# EAGLE design regboard (EAGLE 5.12)
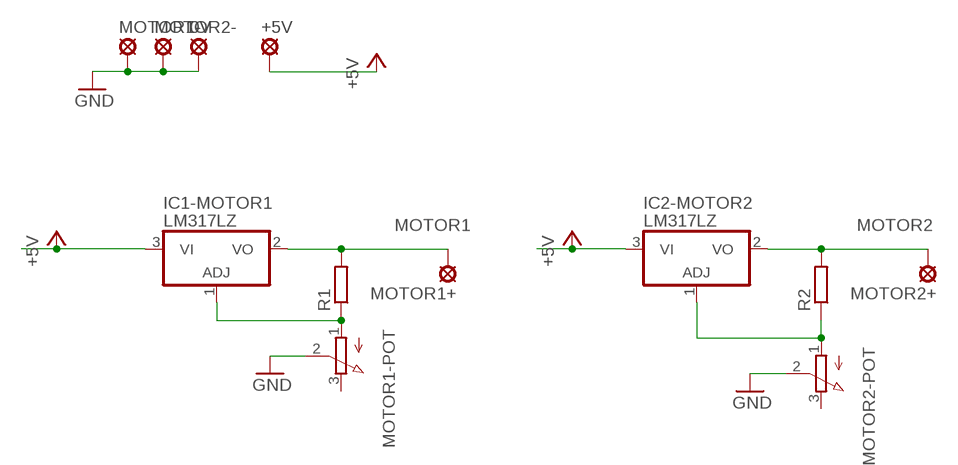
[diagram p0: schematic, sheet 1]

## Parts
0V  SE11  [SE11]
+5V  SE11  [SE11]
IC1-MOTOR1  LM317LZ  [TO92]
IC2-MOTOR2  LM317LZ  [TO92]
MOTOR1+  SE11  [SE11]
MOTOR1-  SE11  [SE11]
MOTOR1-POT  3RP/1610N  [3RP/1610N]
MOTOR2+  SE11  [SE11]
MOTOR2-  SE11  [SE11]
MOTOR2-POT  3RP/1610N  [3RP/1610N]
R1  R-EU_0207/12  [0207/12]
R2  R-EU_0207/12  [0207/12]

## Nets
+5V: +5V.MP IC1-MOTOR1.3(VI) IC2-MOTOR2.3(VI)
GND: 0V.MP MOTOR1-.MP MOTOR1-POT.2(S) MOTOR2-.MP MOTOR2-POT.2(S)
MOTOR1: IC1-MOTOR1.2(VO) MOTOR1+.MP R1.2
MOTOR2: IC2-MOTOR2.2(VO) MOTOR2+.MP R2.2
N$7: IC1-MOTOR1.1(ADJ) MOTOR1-POT.1(A) R1.1
N$8: IC2-MOTOR2.1(ADJ) MOTOR2-POT.1(A) R2.1
Unconnected: MOTOR1-POT.3(E) MOTOR2-POT.3(E)

## Library data of the parts
0V +5V MOTOR1+ MOTOR1- MOTOR2+ MOTOR2- = solpad:SE11: SOLDER PAD RTM, drill 1,1mm, distributor Buerklin, 07F810
IC1-MOTOR1 IC2-MOTOR2 = matt:*317: Positive VOLTAGE REGULATOR
MOTOR1-POT MOTOR2-POT = pot:3RP/1610N: 16mm Potentiometer one level Source: http://www.alphapotentiometers.net/html/16mm_pot_2.html
R1 R2 = matt rcl:R-EU_: RESISTOR, European symbol

## Net classes
0 default: width 0.381 mm

## Board
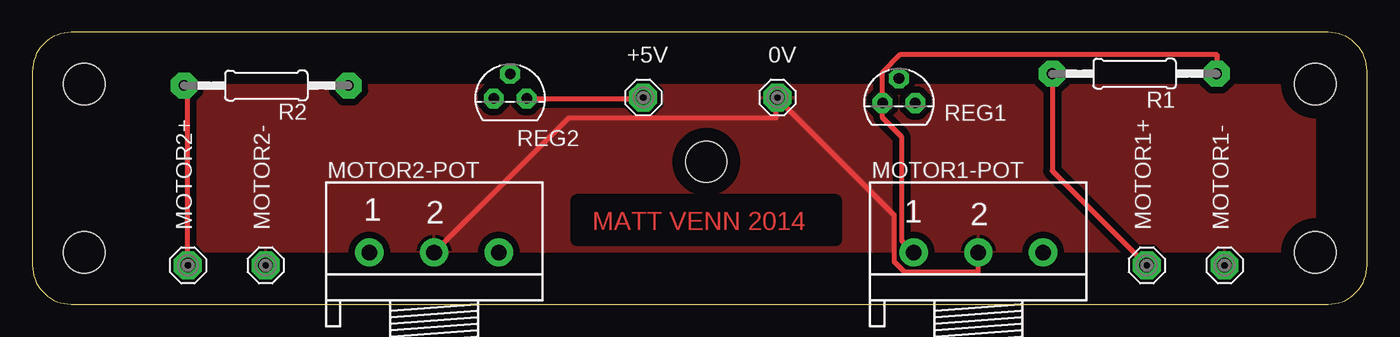
[diagram p1: board, top side]
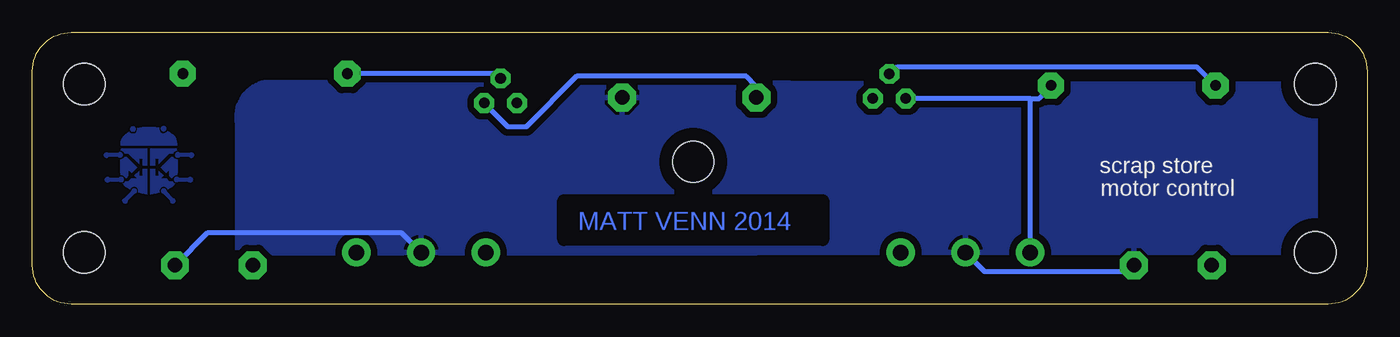
[diagram p2: board, bottom side, seen from below]

Size 103 x 21 mm. Coordinates in mm from the lower left corner, seen from the top.
Outline: 3,21 arc90 0,18 0,3 arc90 3,0 100,0 arc90 103,3 103,18 arc90 100,21 3,21
Copper layers (1*16): Top 0.035mm / dielectric 1.5mm / Bottom 0.035mm
Design rules "default": minimum track width 10mil, minimum drill 24mil, track to track 8mil, track to pad 8mil, pad to pad 8mil, via to via 8mil, smd to smd 8mil, copper to edge 40mil, drill to drill 8mil, minimum pad ring 10mil, minimum via ring 8mil, stop-mask expansion 4mil, vias tented up to drill 0mil, thermal gap 10mil
Holes 3.2 mm at 52,11 4,4 4,17 99,17 99,4
tRestrict: area 42,5 to 62,8
bRestrict: area 42,5 to 62,8

### Footprints (pad centres in the part's own frame; a part is rotated, then mirrored left to right if it is on the bottom)
SE11 = drill 1.118 pad 2.159 octagon: MP 0,0
TO92 = drill 0.813 pad 1.524 octagon: 1 -1.27,0; 2 0,1.905; 3 1.27,0
3RP/1610N = drill 1.2 pad 2.184 round: 1 -5,0; 2 0,0; 3 5,0
0207/12 = drill 0.813 pad 2.032 octagon: 1 -6.35,0; 2 6.35,0

### Placement (x,y rotation side)
0V  57.49,15.97 0 top
+5V  47.14,15.97 0 top
IC1-MOTOR1  66.87,15.54 0 top
IC2-MOTOR2  36.87,15.89 0 top
MOTOR1+  86,3 0 top
MOTOR1-  92,3 0 top
MOTOR1-POT  73,4 0 top
MOTOR2+  12,3 0 top
MOTOR2-  18,3 0 top
MOTOR2-POT  31,4 0 top
R1  85.05,17.81 180 top
R2  18.05,16.89 180 top

### Tracks (layer width: path | path; a pad name or v marks a point on that pad's centre or on a via)
+5V
  Top 0.381: IC2-MOTOR2.3 38.2,15.9 47.1,15.9 +5V.MP
  Bottom 0.381: IC1-MOTOR1.3 66.3,13.7 64.9,13.7 61,17.6 47.9,17.6 47.2,16.9 47.2,16 +5V.MP
GND
  Top 0.381: MOTOR1-POT.2 73,2.5 67.3,2.5 66.5,3.3 66.5,6.9 57.5,15.9 0V.MP 57.4,15.8 57.4,14.4 41.4,14.4 MOTOR2-POT.2
  Bottom 0.381: MOTOR2-.MP 18.5,2.5 29.5,2.5 MOTOR2-POT.2 | MOTOR1-.MP 89.5,5.5 74.5,5.5 MOTOR1-POT.2
  pour Bottom (isolate 0.5): 4,17 85.01,17.14 arc-90 87.17,13.93 87.17,3.93 7,4 arc-90 4,7
  pour Top (isolate 0.5): 4,17 96,17 arc-90 99,14 99,4 7,4 arc-90 4,7
MOTOR1
  Top 0.381: MOTOR1+.MP 78.7,10.3 R1.2
  Bottom 0.381: IC1-MOTOR1.2 66.9,17.5 67.2,17.8 R1.2
MOTOR2
  Top 0.381: MOTOR2+.MP 12,16.5 11.7,16.8 R2.2
  Bottom 0.381: 36.6,18 36.8,17.8 IC2-MOTOR2.2 36.5,18.1 36.3,18.3 13.1,18.3 R2.2
N$1
  pour Bottom: 93.5,13.67 93.2,13.64 93.22,13.53 93.2,13.4 93.12,13.29 93.01,13.22 92.88,13.19 92.78,13.21 92.7,13.25 92.63,13.31 92.58,13.39 92.42,13.28 92.27,13.19 92.15,13.09 92.04,12.99 91.95,12.88 91.89,12.74 91.85,12.58 91.84,12.38 91.84,12.3 91.84,12.26 96.18,12.26 96.19,12.3 96.19,12.38 96.17,12.57 96.14,12.72 96.08,12.84 96.01,12.94 95.91,13.04 95.8,13.13 95.68,13.22 95.53,13.32 95.48,13.26 95.41,13.21 95.33,13.18 95.25,13.16 95.11,13.19 95.01,13.26 94.93,13.37 94.91,13.5 94.93,13.62 94.73,13.65 94.52,13.67
N$2
  pour Bottom: 93.09,13.56 93.08,13.52 93.07,13.48 93.05,13.44 93.03,13.41 92.99,13.38 92.96,13.36 92.92,13.35 92.88,13.35 92.83,13.35 92.79,13.36 92.76,13.38 92.73,13.41 92.7,13.44 92.68,13.48 92.67,13.52 92.66,13.56 92.67,13.6 92.68,13.64 92.7,13.68 92.73,13.71 92.76,13.73 92.79,13.75 92.83,13.77 92.88,13.77 92.92,13.77 92.96,13.75 92.99,13.73 93.03,13.71 93.05,13.68 93.07,13.64 93.08,13.6
N$3
  pour Bottom: 95.45,13.53 95.45,13.49 95.43,13.45 95.42,13.41 95.39,13.38 95.36,13.36 95.32,13.34 95.28,13.32 95.24,13.32 95.2,13.32 95.16,13.34 95.12,13.36 95.09,13.38 95.06,13.41 95.04,13.45 95.03,13.49 95.03,13.53 95.03,13.57 95.04,13.61 95.06,13.65 95.09,13.68 95.12,13.71 95.16,13.73 95.2,13.74 95.24,13.74 95.28,13.74 95.32,13.73 95.36,13.71 95.39,13.68 95.42,13.65 95.43,13.61 95.45,13.57
N$4
  pour Bottom: 91.78,11.74 91.73,11.74 91.68,11.72 91.64,11.69 91.61,11.66 90.89,11.66 90.82,11.71 90.74,11.72 90.7,11.72 90.66,11.71 90.62,11.69 90.59,11.66 90.57,11.63 90.55,11.59 90.53,11.55 90.53,11.51 90.53,11.47 90.55,11.43 90.57,11.39 90.59,11.36 90.62,11.34 90.66,11.32 90.7,11.3 90.74,11.3 90.79,11.31 90.84,11.32 90.88,11.35 90.92,11.39 91.62,11.39 91.65,11.36 91.69,11.34 91.73,11.32 91.78,11.32 91.82,11.32 91.86,11.33 91.9,11.35 91.93,11.38 91.95,11.41 91.97,11.45 91.98,11.49 91.99,11.53 91.98,11.57 91.97,11.61 91.95,11.65 91.93,11.68 91.9,11.71 91.86,11.72 91.82,11.74
N$5
  pour Bottom: 91.86,12.02 91.86,12.01 91.85,11.98 91.85,11.93 91.84,11.86 91.93,11.84 92.02,11.8 92.08,11.74 92.13,11.66 92.43,11.66 93.24,10.84 93.24,11.25 93.51,11.25 93.51,10.71 93.89,10.71 93.89,12.02
N$6
  pour Bottom: 92.13,11.39 92.08,11.3 92.01,11.24 91.92,11.2 91.82,11.18 91.8,11.18 91.79,10.88 91.79,10.57 91.8,10.26 91.82,9.97 91.88,9.97 91.98,9.96 92.08,9.91 92.15,9.84 92.2,9.76 92.29,9.76 92.43,9.89 92.43,10.38 92.67,10.14 93.11,10.57 92.29,11.39
N$7
  Top 0.381: R1.1 91.4,19.3 67,19.3 65.6,17.9 IC1-MOTOR1.1 65.6,14.4 67.1,12.9 67.1,4.9 MOTOR1-POT.1
N$8
  Bottom 0.381: 26,15.9 IC2-MOTOR2.1 | 26,15.9 25.3,15.9 24.4,16.8 R2.1 | MOTOR2-POT.1 26,15.9
N$9
  pour Bottom: 93.51,10.44 93.51,9.89 93.24,9.89 93.24,10.3 92.88,9.93 93.11,9.7 92.64,9.7 92.43,9.48 92.19,9.48 92.15,9.43 92.11,9.38 92.05,9.34 91.99,9.31 91.99,9.31 92.09,9.18 92.22,9.06 92.37,8.96 92.55,8.87 92.6,8.95 92.67,9.02 92.76,9.06 92.86,9.07 92.99,9.05 93.1,8.98 93.17,8.87 93.2,8.73 93.19,8.64 93.33,8.6 93.46,8.57 93.58,8.55 93.68,8.53 93.77,8.51 93.84,8.5 93.88,8.49 93.89,8.49 93.89,10.44
N$10
  pour Bottom: 91.86,9.85 91.81,9.84 91.77,9.82 91.73,9.8 91.69,9.77 90.97,9.77 90.9,9.81 90.82,9.83 90.78,9.82 90.74,9.81 90.7,9.79 90.67,9.77 90.65,9.73 90.63,9.7 90.61,9.66 90.61,9.62 90.61,9.57 90.63,9.53 90.65,9.5 90.67,9.47 90.7,9.44 90.74,9.42 90.78,9.41 90.82,9.4 90.87,9.41 90.92,9.43 90.96,9.46 91,9.49 91.7,9.49 91.73,9.47 91.77,9.44 91.81,9.43 91.86,9.42 91.9,9.43 91.94,9.44 91.98,9.46 92.01,9.49 92.03,9.52 92.05,9.55 92.07,9.59 92.07,9.64 92.07,9.68 92.05,9.72 92.03,9.75 92.01,9.78 91.98,9.81 91.94,9.83 91.9,9.84
N$11
  pour Bottom: 92.86,8.96 92.78,8.94 92.71,8.89 92.66,8.81 92.65,8.71 92.15,8.19 92.08,8.18 92.01,8.13 91.96,8.06 91.95,7.98 91.97,7.9 92.02,7.83 92.09,7.78 92.17,7.77 92.25,7.79 92.31,7.84 92.35,7.88 92.37,7.92 92.37,7.97 92.37,8.02 92.86,8.53 92.94,8.55 93.02,8.6 93.06,8.67 93.08,8.75 93.06,8.83 93.01,8.9 92.94,8.94
N$12
  pour Bottom: 96.24,11.74 96.2,11.74 96.16,11.72 96.12,11.71 96.09,11.68 96.06,11.65 96.04,11.61 96.03,11.57 96.03,11.53 96.03,11.49 96.04,11.45 96.06,11.41 96.09,11.38 96.12,11.35 96.16,11.33 96.2,11.32 96.24,11.32 96.33,11.34 96.4,11.39 97.1,11.39 97.14,11.35 97.18,11.32 97.22,11.31 97.28,11.3 97.32,11.3 97.36,11.32 97.39,11.34 97.42,11.36 97.45,11.39 97.47,11.43 97.48,11.47 97.49,11.51 97.48,11.55 97.47,11.59 97.45,11.63 97.42,11.66 97.39,11.69 97.36,11.71 97.32,11.72 97.28,11.72 97.19,11.71 97.13,11.66 96.4,11.66 96.37,11.69 96.33,11.72 96.29,11.74
N$13
  pour Bottom: 96.16,12.02 96.16,12.01 96.16,11.98 96.17,11.93 96.18,11.86 96.08,11.84 96,11.8 95.94,11.74 95.89,11.66 95.59,11.66 94.77,10.84 94.77,11.25 94.5,11.25 94.5,10.71 94.12,10.71 94.12,12.02
N$14
  pour Bottom: 95.89,11.39 95.94,11.3 96.01,11.24 96.1,11.2 96.2,11.18 96.22,11.18 96.23,10.88 96.23,10.57 96.22,10.26 96.2,9.97 96.14,9.97 96.03,9.96 95.94,9.91 95.87,9.84 95.82,9.76 95.73,9.76 95.59,9.89 95.59,10.38 95.35,10.14 94.91,10.57 95.73,11.39
N$15
  pour Bottom: 94.5,10.44 94.5,9.89 94.77,9.89 94.77,10.3 95.14,9.93 94.91,9.7 95.37,9.7 95.59,9.48 95.83,9.48 95.86,9.43 95.91,9.38 95.96,9.34 96.03,9.31 96.02,9.31 95.93,9.18 95.8,9.06 95.64,8.96 95.47,8.87 95.42,8.95 95.35,9.02 95.26,9.06 95.16,9.07 95.02,9.05 94.92,8.98 94.84,8.87 94.82,8.73 94.83,8.64 94.69,8.6 94.56,8.57 94.44,8.55 94.33,8.53 94.24,8.51 94.18,8.5 94.14,8.49 94.12,8.49 94.12,10.44
N$16
  pour Bottom: 96.16,9.85 96.12,9.84 96.08,9.83 96.04,9.81 96.01,9.78 95.98,9.75 95.96,9.72 95.95,9.68 95.95,9.64 95.95,9.59 95.96,9.55 95.98,9.52 96.01,9.49 96.04,9.46 96.08,9.44 96.12,9.43 96.16,9.42 96.2,9.43 96.25,9.44 96.28,9.47 96.32,9.49 97.02,9.49 97.05,9.46 97.1,9.43 97.14,9.41 97.19,9.4 97.24,9.41 97.28,9.42 97.31,9.44 97.34,9.47 97.37,9.5 97.39,9.53 97.4,9.57 97.41,9.62 97.4,9.66 97.39,9.7 97.37,9.73 97.34,9.77 97.31,9.79 97.28,9.81 97.24,9.82 97.19,9.83 97.11,9.81 97.05,9.77 96.32,9.77 96.29,9.8 96.25,9.82 96.21,9.84
N$17
  pour Bottom: 95.16,8.96 95.08,8.94 95.01,8.9 94.96,8.83 94.94,8.75 94.96,8.67 95,8.6 95.08,8.55 95.16,8.53 95.65,8.02 95.64,7.97 95.65,7.92 95.67,7.88 95.7,7.84 95.77,7.79 95.85,7.77 95.93,7.78 96,7.83 96.05,7.9 96.07,7.98 96.05,8.06 96.01,8.13 95.94,8.18 95.86,8.19 95.36,8.72 95.36,8.81 95.31,8.89 95.24,8.94

### Text on the board
Top: MATT VENN 2014
Bottom: MATT VENN 2014
tNames: REG1 | REG2 | 1 | 2 | 1 | 2
bNames: scrap store | motor control